# EAGLE design eight_step_sequencer (EAGLE 5.07)
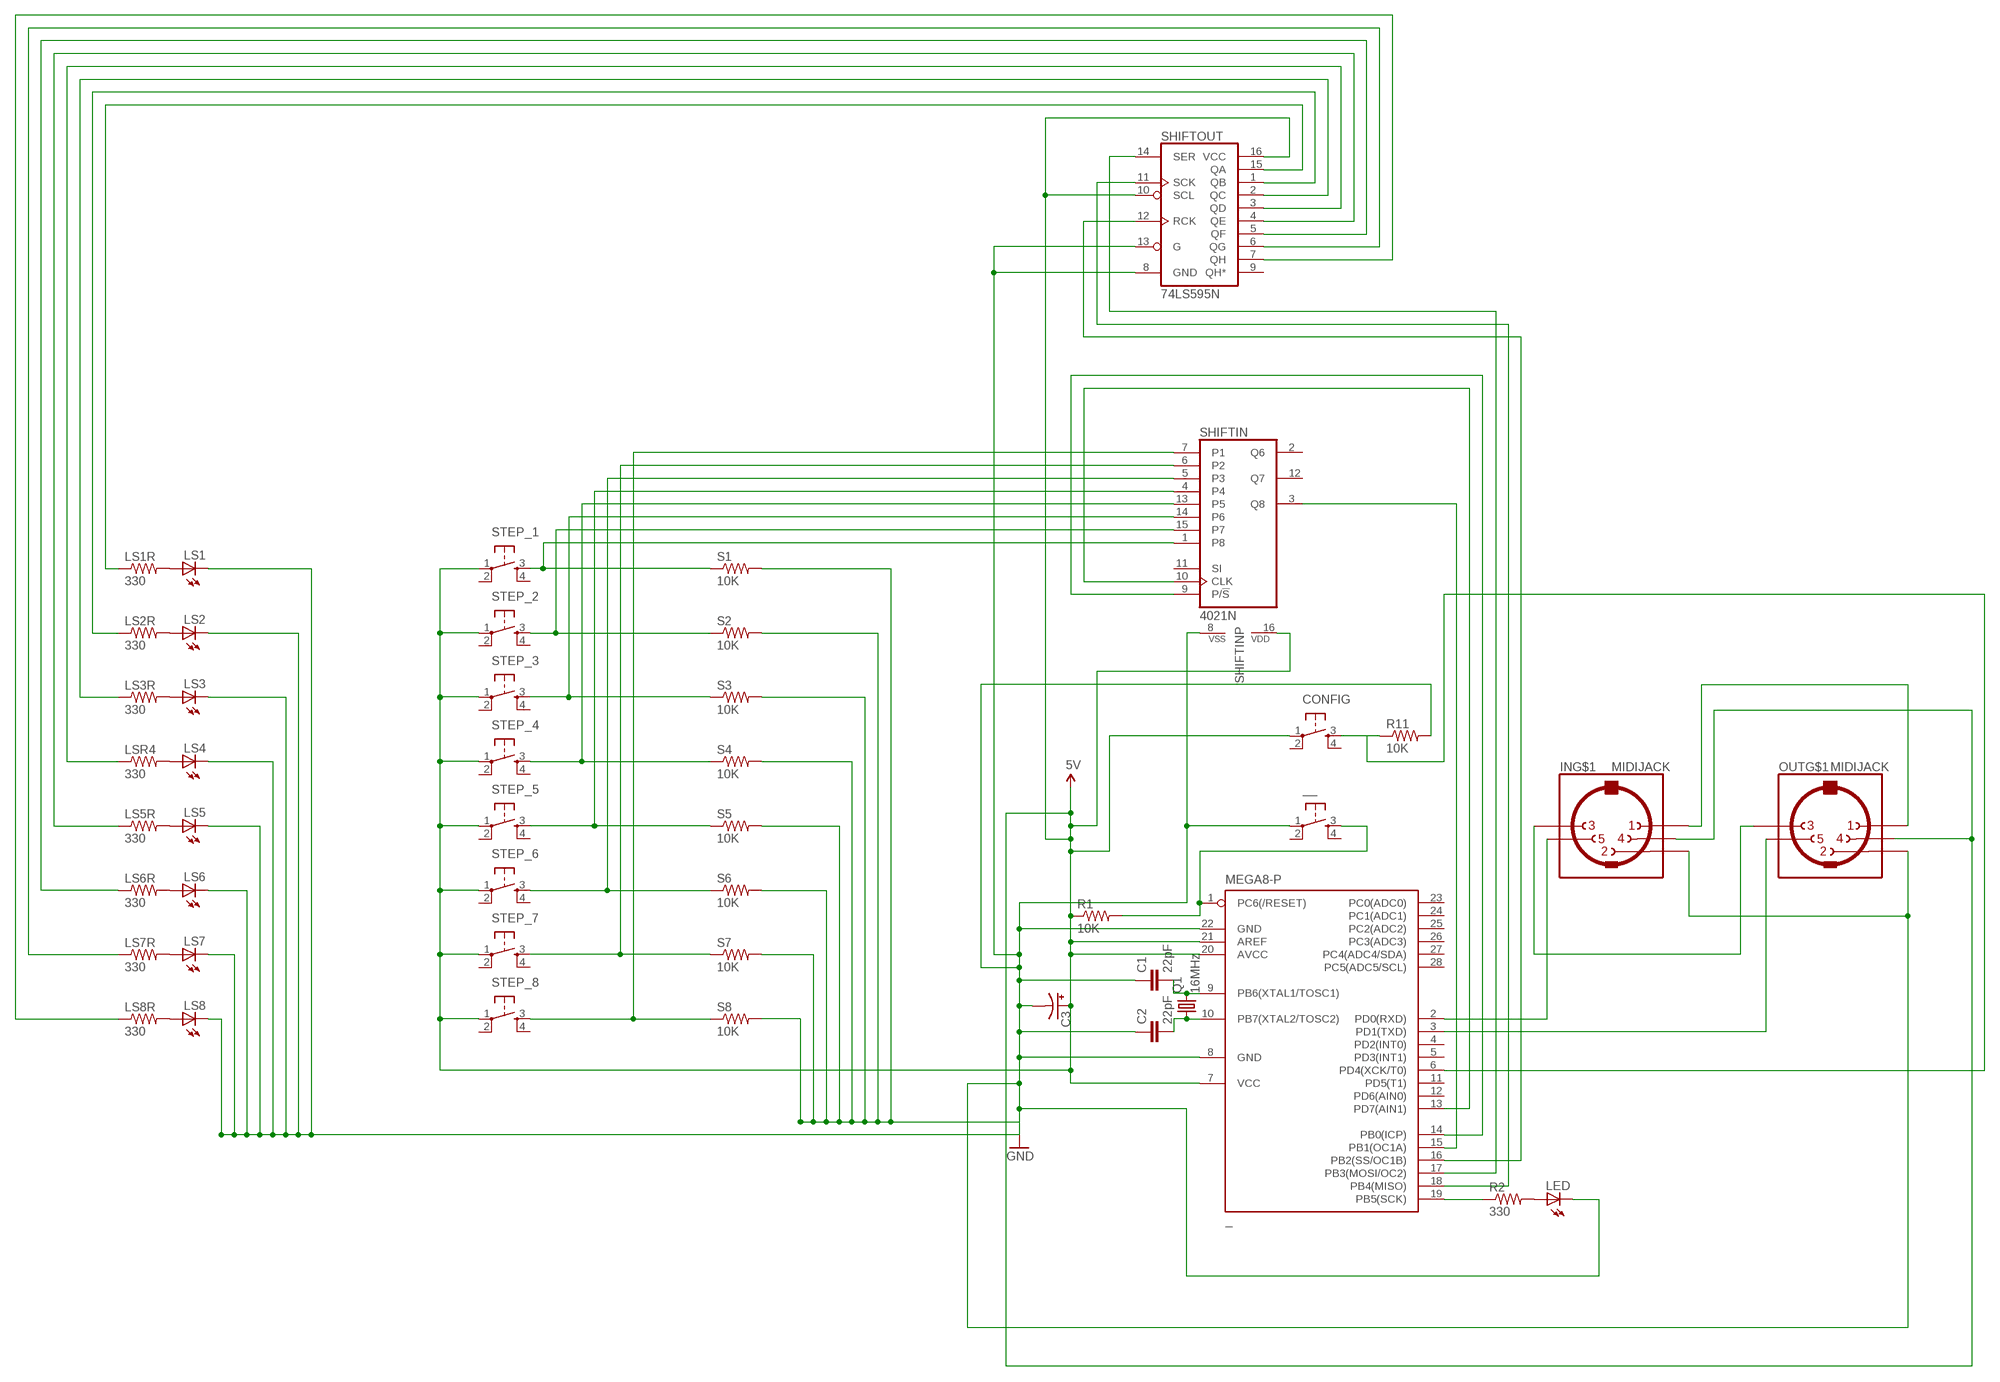
[diagram p0: schematic, sheet 1]

## Parts
_  MEGA8-P  [DIL28-3]
__  TAC_SWITCHPTH  [TACTILE-PTH]
C1  22pF  CAPPTH  [CAP-PTH-SMALL]
C2  22pF  CAPPTH  [CAP-PTH-SMALL]
C3  CAP_POLPTH2  [CPOL-RADIAL-10UF-25V]
CONFIG  TAC_SWITCHPTH  [TACTILE-PTH]
IN  MIDIJACK  [CP-2350]
LED  LED5MM  [LED5MM]
LS1  LED5MM  [LED5MM]
LS1R  330  RESISTORPTH-1/6W  [1/6W-RES]
LS2  LED5MM  [LED5MM]
LS2R  330  RESISTORPTH-1/6W  [1/6W-RES]
LS3  LED5MM  [LED5MM]
LS3R  330  RESISTORPTH-1/6W  [1/6W-RES]
LS4  LED5MM  [LED5MM]
LS5  LED5MM  [LED5MM]
LS5R  330  RESISTORPTH-1/6W  [1/6W-RES]
LS6  LED5MM  [LED5MM]
LS6R  330  RESISTORPTH-1/6W  [1/6W-RES]
LS7  LED5MM  [LED5MM]
LS7R  330  RESISTORPTH-1/6W  [1/6W-RES]
LS8  LED5MM  [LED5MM]
LS8R  330  RESISTORPTH-1/6W  [1/6W-RES]
LSR4  330  RESISTORPTH-1/6W  [1/6W-RES]
OUT  MIDIJACK  [CP-2350]
Q1  16MHz  CRYSTALHC49U-V  [HC49U-V]
R1  10K  RESISTORPTH-1/6W  [1/6W-RES]
R2  330  RESISTORPTH-1/6W  [1/6W-RES]
R11  10K  RESISTORPTH-1/6W  [1/6W-RES]
S1  10K  RESISTORPTH-1/6W  [1/6W-RES]
S2  10K  RESISTORPTH-1/6W  [1/6W-RES]
S3  10K  RESISTORPTH-1/6W  [1/6W-RES]
S4  10K  RESISTORPTH-1/6W  [1/6W-RES]
S5  10K  RESISTORPTH-1/6W  [1/6W-RES]
S6  10K  RESISTORPTH-1/6W  [1/6W-RES]
S7  10K  RESISTORPTH-1/6W  [1/6W-RES]
S8  10K  RESISTORPTH-1/6W  [1/6W-RES]
SHIFTIN  4021N  [DIL16]
SHIFTOUT  74LS595N  [DIL16]
STEP_1  TAC_SWITCHPTH  [TACTILE-PTH]
STEP_2  TAC_SWITCHPTH  [TACTILE-PTH]
STEP_3  TAC_SWITCHPTH  [TACTILE-PTH]
STEP_4  TAC_SWITCHPTH  [TACTILE-PTH]
STEP_5  TAC_SWITCHPTH  [TACTILE-PTH]
STEP_6  TAC_SWITCHPTH  [TACTILE-PTH]
STEP_7  TAC_SWITCHPTH  [TACTILE-PTH]
STEP_8  TAC_SWITCHPTH  [TACTILE-PTH]

## Nets
5V: _.7(VCC) _.20(AVCC) _.21(AREF) C3.1(+) CONFIG.1 IN.4 OUT.4 R1.1 SHIFTIN.16(VDD) SHIFTOUT.10(SCL) SHIFTOUT.16(VCC) STEP_1.1 STEP_2.1 STEP_3.1 STEP_4.1 STEP_5.1 STEP_6.1 STEP_7.1 STEP_8.1
GND: _.8(GND) _.22(GND) __.1 C1.1 C2.1 C3.2(-) IN.2 LED.K(C) LS1.K(C) LS2.K(C) LS3.K(C) LS4.K(C) LS5.K(C) LS6.K(C) LS7.K(C) LS8.K(C) OUT.2 R11.2 S1.2 S2.2 S3.2 S4.2 S5.2 S6.2 S7.2 S8.2 SHIFTIN.8(VSS) SHIFTOUT.8(GND) SHIFTOUT.13(G)
N$1: _.1(PC6(/RESET)) __.3 R1.2
N$2: _.9(PB6(XTAL1/TOSC1)) C1.2 Q1.2
N$3: _.10(PB7(XTAL2/TOSC2)) C2.2 Q1.1
N$4: _.15(PB1(OC1A)) SHIFTIN.3(Q8)
N$5: _.2(PD0(RXD)) IN.5
N$6: _.3(PD1(TXD)) OUT.5
N$7: IN.3 OUT.3
N$8: IN.1 OUT.1
N$9: _.13(PD7(AIN1)) SHIFTIN.10(CLK)
N$10: _.14(PB0(ICP)) SHIFTIN.9(P/!S)
N$11: S8.1 SHIFTIN.7(P1) STEP_8.3
N$12: _.19(PB5(SCK)) R2.1
N$13: LED.A R2.2
N$14: S1.1 SHIFTIN.1(P8) STEP_1.3
N$15: S2.1 SHIFTIN.15(P7) STEP_2.3
N$16: S3.1 SHIFTIN.14(P6) STEP_3.3
N$17: S4.1 SHIFTIN.13(P5) STEP_4.3
N$18: S5.1 SHIFTIN.4 STEP_5.3
N$19: S6.1 SHIFTIN.5(P3) STEP_6.3
N$20: S7.1 SHIFTIN.6(P2) STEP_7.3
N$21: _.17(PB3(MOSI/OC2)) SHIFTOUT.14(SER)
N$22: _.18(PB4(MISO)) SHIFTOUT.11(SCK)
N$23: _.16(PB2(SS/OC1B)) SHIFTOUT.12(RCK)
N$24: LS1.A LS1R.2
N$25: LS2.A LS2R.2
N$26: LS3.A LS3R.2
N$27: LS4.A LSR4.2
N$28: LS5.A LS5R.2
N$29: LS6.A LS6R.2
N$30: LS7.A LS7R.2
N$31: LS8.A LS8R.2
N$32: LS6R.1 SHIFTOUT.5(QF)
N$33: LS1R.1 SHIFTOUT.15(QA)
N$34: LS2R.1 SHIFTOUT.1(QB)
N$35: LS3R.1 SHIFTOUT.2(QC)
N$36: LSR4.1 SHIFTOUT.3(QD)
N$37: LS5R.1 SHIFTOUT.4(QE)
N$39: LS7R.1 SHIFTOUT.6(QG)
N$40: LS8R.1 SHIFTOUT.7(QH)
N$41: _.6(PD4(XCK/T0)) CONFIG.3 R11.1
Unconnected: _.4(PD2(INT0)) _.5(PD3(INT1)) _.11(PD5(T1)) _.12(PD6(AIN0)) _.23(PC0(ADC0)) _.24(PC1(ADC1)) _.25(PC2(ADC2)) _.26(PC3(ADC3)) _.27(PC4(ADC4/SDA)) _.28(PC5(ADC5/SCL)) __.2 __.4 CONFIG.2 CONFIG.4 IN.PE1(MT) IN.PE2(MT) IN.PE(MT) IN.PE@(MT) OUT.PE1(MT) OUT.PE2(MT) OUT.PE(MT) OUT.PE@(MT) SHIFTIN.2(Q6) SHIFTIN.11(SI) SHIFTIN.12(Q7) SHIFTOUT.9(QH*) STEP_1.2 STEP_1.4 STEP_2.2 STEP_2.4 STEP_3.2 STEP_3.4 STEP_4.2 STEP_4.4 STEP_5.2 STEP_5.4 STEP_6.2 STEP_6.4 STEP_7.2 STEP_7.4 STEP_8.2 STEP_8.4

## Library data of the parts
_ = atmel:MEGA8-P: MICROCONTROLLER 8 Kbytes FLASH, 1 kbytes SRAM, 512 bytes EEPROM, USART, 4-channel 10 bit ADC, 2-channel 8 bit ADC Pin compatible with Atmega48, ATMega88, ATMega168 Source: avr.lbr
__ CONFIG STEP_1-STEP_8 = SparkFun:TAC_SWITCH: Momentary Switch Button commonly used for reset or general input. Spark Fun Electronics SKU : COM-00097
C1 C2 = SparkFun:CAP: Capacitor Standard 0603 ceramic capacitor, and 0.1" leaded capacitor.
C3 = SparkFun:CAP_POL: Capacitor Polarized These are standard SMD and PTH capacitors. Normally 10uF, 47uF, and 100uF in electrolytic and tantalum varieties. Always verify the external diameter of the through hole cap, it varies with capacity, voltage, and manufacturer. The EIA devices should be standard.
IN OUT = adafruit:MIDIJACK: DIN 5 jack also known as MIDI jack A modification of conn-hirshman:MAB5SH with two options for the grounding 'teeth'
LED LS1-LS8 = adafruit:LED: LED OSRAM: - CHIPLED LG R971, LG N971, LY N971, LG Q971, LY Q971, LO R971, LY R971 LH N974, LH R974 LS Q976, LO Q976, LY Q976 LO Q996 - Hyper CHIPLED LW Q18S LB Q993, LB Q99A, LB R99A - SideLED LS A670, LO A670, LY A670, LG A670, LP A670 LB A673, LV A673, LT A673, LW A673 LH A674 LY A675 LS A676, LA A676, LO A676, LY A676, LW A676 LS A679, LY A679, LG A679 - Hyper Micro SIDELED® LS Y876, LA Y876, LO Y876, LY Y876 LT Y87S - SmartLED LW L88C, LW L88S LB L89C, LB L89S, LG L890 LS L89K, LO L89K, LY L89K LS L896, LA L896, LO L896, LY L896 - TOPLED LS T670, LO T670, LY T670, LG T670, LP T670 LSG T670, LSP T670, LSY T670, LOP T670, LYG T670 LG T671, LOG T671, LSG T671 LB T673, LV T673, LT T673, LW T673 LH T674 LS T676, LA T676, LO T676, LY T676, LB T676, LH T676, LSB T676, LW T676 LB T67C, LV T67C, LT T67C, LS T67K, LO T67K, LY T67K, LW E67C LS E67B, LA E67B, LO E67B, LY E67B, LB E67C, LV E67C, LT E67C LW T67C LS T679, LY T679, LG T679 LS T770, LO T770, LY T770, LG T770, LP T770 LB T773, LV T773, LT T773, LW T773 LH T774 LS E675, LA E675, LY E675, LS T675 LS T776, LA T776, LO T776, LY T776, LB T776 LHGB T686 LT T68C, LB T68C - Hyper Mini TOPLED® LB M676 - Mini TOPLED Santana® LG M470 LS M47K, LO M47K, LY M47K Source: http://www.osram.convergy.de/
LS1R LS2R LS3R LS5R LS6R LS7R LS8R LSR4 R1 R2 R11 S1-S8 = SparkFun:RESISTOR: Resistor Basic schematic elements and footprints for 0603, 1206, and PTH resistors.
Q1 = crystal:CRYSTAL: CRYSTAL
SHIFTIN = 40xx:4021: 8-bit static SHIFT REGISTER
SHIFTOUT = SparkFun:74*595: 8-bit SHIFT REGISTER, output latch

## Board
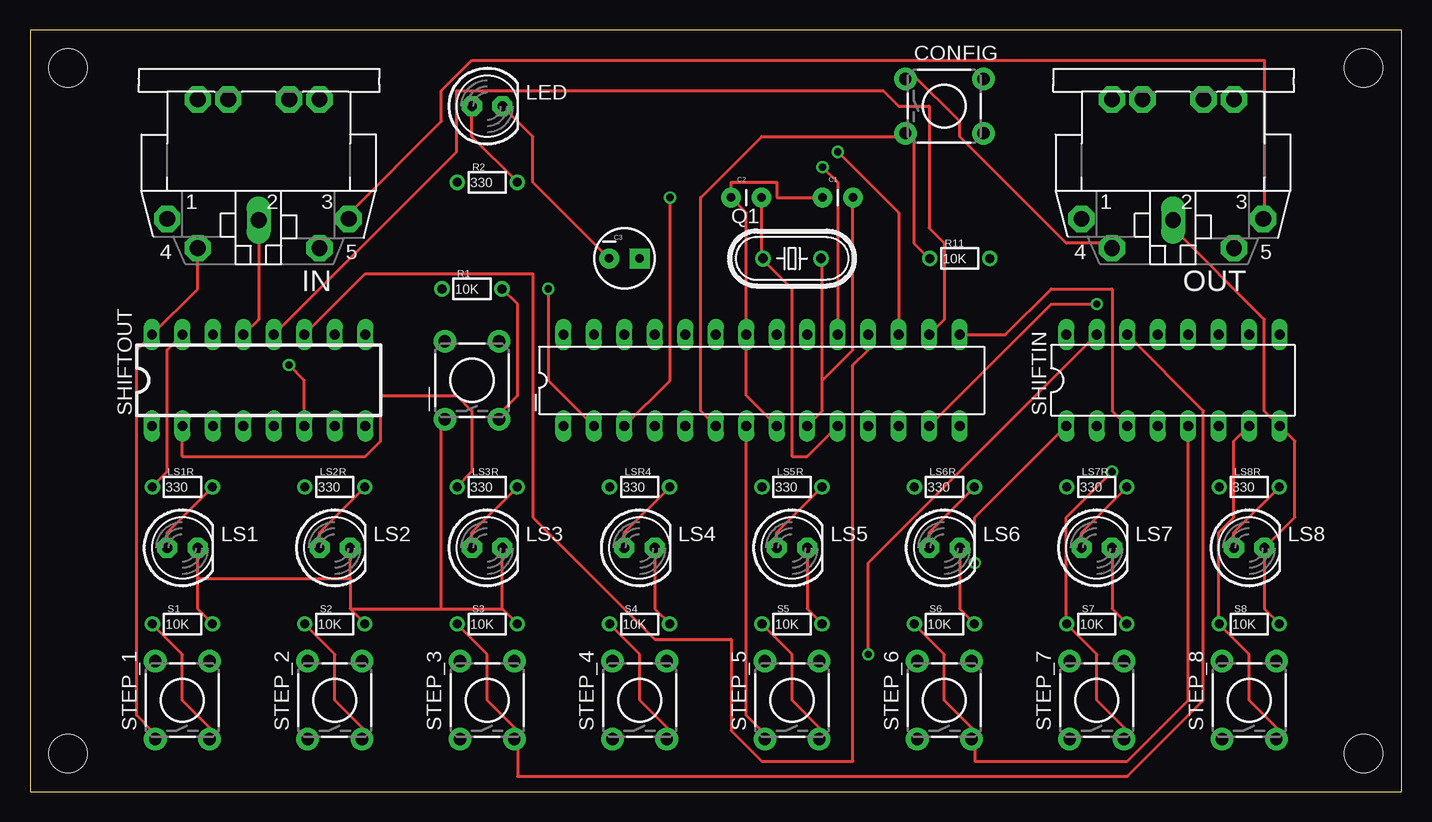
[diagram p1: board, top side]
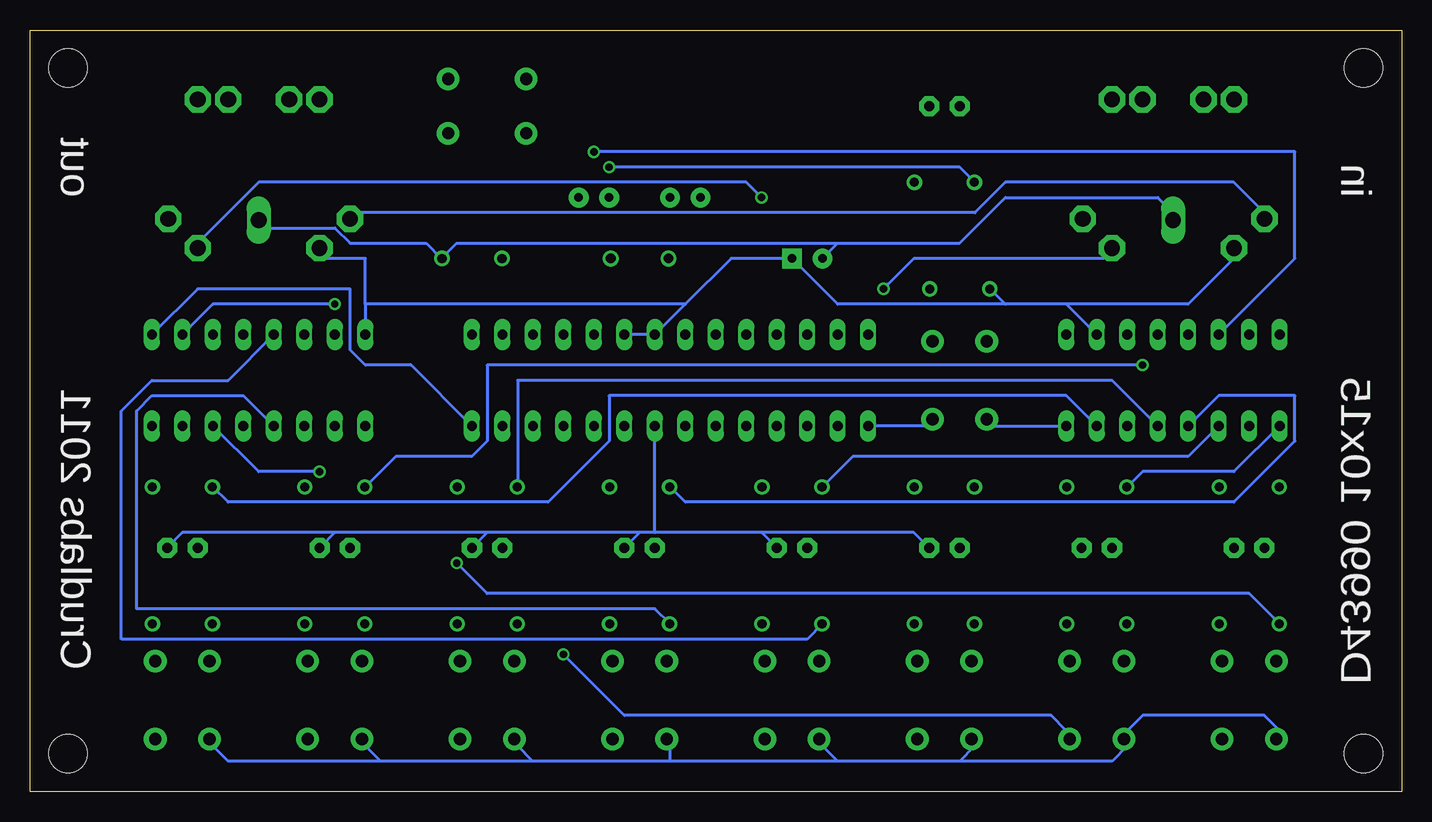
[diagram p2: board, bottom side, seen from below]

Size 114.3 x 63.5 mm. Coordinates in mm from the lower left corner, seen from the top.
Outline: 0,0 114.3,0 114.3,63.5 0,63.5 0,0
Copper layers (1*16): Top 0.035mm / dielectric 1.5mm / Bottom 0.035mm
Design rules "default": minimum track width 10mil, minimum drill 24mil, track to track 8mil, track to pad 8mil, pad to pad 8mil, via to via 8mil, smd to smd 8mil, copper to edge 40mil, drill to drill 8mil, minimum pad ring 10mil, minimum via ring 8mil, stop-mask expansion 4mil, vias tented up to drill 0mil, thermal gap 10mil
Holes 3.17 mm at 3.17,3.17 3.17,60.33 111.12,3.17 111.12,60.33

### Footprints (pad centres in the part's own frame; a part is rotated, then mirrored left to right if it is on the bottom)
DIL28-3 = drill 0.813 long: 1 -16.51,-3.81; 2 -13.97,-3.81; 3 -11.43,-3.81; 4 -8.89,-3.81; 5 -6.35,-3.81; 6 -3.81,-3.81; 7 -1.27,-3.81; 8 1.27,-3.81; 9 3.81,-3.81; 10 6.35,-3.81; 11 8.89,-3.81; 12 11.43,-3.81; 13 13.97,-3.81; 14 16.51,-3.81; 15 16.51,3.81; 16 13.97,3.81; 17 11.43,3.81; 18 8.89,3.81; 19 6.35,3.81; 20 3.81,3.81; 21 1.27,3.81; 22 -1.27,3.81; 23 -3.81,3.81; 24 -6.35,3.81; 25 -8.89,3.81; 26 -11.43,3.81; 27 -13.97,3.81; 28 -16.51,3.81
TACTILE-PTH = drill 1.016 pad 1.88 round: 1 -3.251,2.261; 2 3.251,2.261; 3 -3.251,-2.261; 4 3.251,-2.261
CAP-PTH-SMALL = drill 0.7 pad 1.651 round: 1 0,0; 2 2.54,0
CPOL-RADIAL-10UF-25V = drill 0.7 pad 1.651 square: 1 1.27,0 | drill 0.7 pad 1.651 round: 2 -1.27,0
CP-2350 = drill 1.321 pad 2.184 octagon: 1 7.62,12.58; 3 -7.52,12.58; 4 5.08,15.02; 5 -5.08,15.02; PE -2.54,2.62; PE1 -5.08,2.62; PE2 5.08,2.62; PE@ 2.54,2.62 | drill 1.321 long: 2 0,12.68
LED5MM = drill 0.813 pad 1.676 octagon: A -1.27,0; K 1.27,0
1/6W-RES = drill 0.762 round: 1 -2.5,0; 2 2.5,0
HC49U-V = drill 0.813 round: 1 -2.413,0; 2 2.413,0
DIL16 = drill 0.813 long: 1 -8.89,-3.81; 2 -6.35,-3.81; 3 -3.81,-3.81; 4 -1.27,-3.81; 5 1.27,-3.81; 6 3.81,-3.81; 7 6.35,-3.81; 8 8.89,-3.81; 9 8.89,3.81; 10 6.35,3.81; 11 3.81,3.81; 12 1.27,3.81; 13 -1.27,3.81; 14 -3.81,3.81; 15 -6.35,3.81; 16 -8.89,3.81

### Placement (x,y rotation side)
_  60.96,34.29 0 top
__  36.83,34.29 90 top
C1  66.04,49.53 0 top
C2  58.42,49.53 0 top
C3  49.53,44.45 0 top
CONFIG  76.2,57.15 0 top
IN  19.05,60.33 180 top
LED  38.1,57.15 0 top
LS1  12.7,20.32 0 top
LS1R  12.7,25.4 0 top
LS2  25.4,20.32 0 top
LS2R  25.4,25.4 0 top
LS3  38.1,20.32 0 top
LS3R  38.1,25.4 0 top
LS4  50.8,20.32 0 top
LS5  63.5,20.32 0 top
LS5R  63.5,25.4 0 top
LS6  76.2,20.32 0 top
LS6R  76.2,25.4 0 top
LS7  88.9,20.32 0 top
LS7R  88.9,25.4 0 top
LS8  101.6,20.32 0 top
LS8R  101.6,25.4 0 top
LSR4  50.8,25.4 0 top
OUT  95.25,60.33 180 top
Q1  63.5,44.45 0 top
R1  36.83,41.91 0 top
R2  38.1,50.8 0 top
R11  77.47,44.45 0 top
S1  12.7,13.97 0 top
S2  25.4,13.97 0 top
S3  38.1,13.97 0 top
S4  50.8,13.97 0 top
S5  63.5,13.97 0 top
S6  76.2,13.97 0 top
S7  88.9,13.97 0 top
S8  101.6,13.97 0 top
SHIFTIN  95.25,34.29 0 top
SHIFTOUT  19.05,34.29 0 top
STEP_1  12.7,7.62 90 top
STEP_2  25.4,7.62 90 top
STEP_3  38.1,7.62 90 top
STEP_4  50.8,7.62 90 top
STEP_5  63.5,7.62 90 top
STEP_6  76.2,7.62 90 top
STEP_7  88.9,7.62 90 top
STEP_8  101.6,7.62 90 top
U$2  [CRUDLABS_LOGO_1]  3.81,40.64 0 top

### Tracks (layer width: path | path; a pad name or v marks a point on that pad's centre or on a via)
5V
  Top 0.254: CONFIG.1 73.66,59.69 77.47,55.88 77.47,54.61 86.36,45.72 90.17,45.72 OUT.4 | IN.4 13.97,41.91 SHIFTOUT.16 8.89,36.83 8.89,6.35 10.16,5.08 STEP_1.1 | _.7 59.69,6.35 60.96,5.08 STEP_5.1
  Bottom 0.254: 86.36,40.64 86.36,44.45 90.17,44.45 OUT.4 | 86.36,40.64 SHIFTIN.16 | _.20 _.21 59.69,40.64 | 33.02,40.64 34.29,41.91 R1.1 | 27.94,40.64 33.02,40.64 | 27.94,40.64 SHIFTOUT.10 | 33.02,40.64 46.99,40.64 C3.1 55.88,44.45 59.69,40.64 | 27.94,40.64 17.78,40.64 13.97,44.45 IN.4 | 59.69,40.64 86.36,40.64 | STEP_1.1 10.16,5.08 11.43,6.35 21.59,6.35 22.86,5.08 STEP_2.1 22.86,3.81 24.13,2.54 36.83,2.54 | 36.83,2.54 35.56,3.81 STEP_3.1 | 36.83,2.54 46.99,2.54 | 46.99,2.54 48.26,3.81 STEP_4.1 | 72.39,2.54 73.66,3.81 STEP_6.1 | 46.99,2.54 60.96,2.54 | 60.96,2.54 72.39,2.54 | 85.09,2.54 86.36,3.81 STEP_7.1 | 72.39,2.54 85.09,2.54 | 85.09,2.54 97.79,2.54 99.06,3.81 STEP_8.1 | 60.96,2.54 60.96,3.81 STEP_5.1
GND
  Top 0.254: SHIFTOUT.13 19.05,39.37 IN.2 | C3.2 41.91,50.8 41.91,54.61 LED.K | 39.37,15.24 40.64,13.97 S3.2 | 39.37,15.24 LS3.K | 13.97,17.78 LS1.K | 13.97,17.78 13.97,15.24 15.24,13.97 S1.2 | 26.67,15.24 27.94,13.97 S2.2 | 26.67,17.78 LS2.K | 26.67,17.78 26.67,15.24 | 13.97,17.78 26.67,17.78 | 26.67,15.24 34.29,15.24 | 34.29,15.24 39.37,15.24 | 34.29,15.24 34.29,30.48 __.1 | _.8 59.69,33.02 _.22 59.69,48.26 C2.1 58.42,50.8 62.23,50.8 62.23,49.53 C1.1 | S8.2 104.14,13.97 102.87,15.24 LS8.K 105.41,22.86 105.41,29.21 SHIFTIN.8 102.87,31.75 102.87,39.37 95.25,46.99 OUT.2 | LS7.K 90.17,15.24 91.44,13.97 S7.2 | LS6.K 77.47,15.24 78.74,13.97 S6.2 | LS4.K 52.07,15.24 53.34,13.97 S4.2 | LS5.K 64.77,15.24 66.04,13.97 S5.2
  Bottom 0.254: 80.01,44.45 81.28,45.72 87.63,45.72 88.9,46.99 95.25,46.99 OUT.2 | 46.99,45.72 36.83,45.72 33.02,49.53 20.32,49.53 19.05,48.26 IN.2 | 46.99,45.72 C3.2 | 80.01,44.45 78.74,45.72 46.99,45.72 | 80.01,44.45 R11.2 | SHIFTOUT.8 34.29,30.48 __.1 | 53.34,21.59 LS4.K | 62.23,21.59 63.5,21.59 | 53.34,21.59 62.23,21.59 | 63.5,21.59 LS5.K | 76.2,21.59 LS6.K | 63.5,21.59 76.2,21.59 | 88.9,21.59 LS7.K | 76.2,21.59 88.9,21.59 | LS8.K 101.6,21.59 88.9,21.59 | 62.23,21.59 _.8 | LS3.K 40.64,21.59 53.34,21.59
N$1
  Top 0.254: R1.2 39.37,41.91 40.64,40.64 40.64,33.02 39.37,31.75 __.3
  Bottom 0.254: _.1 39.37,30.48 __.3
N$2
  Top 0.254: _.9 66.04,31.75 66.04,34.29 | 66.04,34.29 66.04,44.45 Q1.2 | C1.2 68.58,36.83 66.04,34.29
N$3
  Top 0.254: _.10 64.77,27.94 63.5,27.94 63.5,41.91 60.96,44.45 | 60.96,44.45 C2.2 | 60.96,44.45 Q1.1
N$4
  Top 0.254: _.15 81.28,38.1 85.09,41.91 90.17,41.91 90.17,31.75 SHIFTIN.3
N$5  (via drill 0.61)
  Top 0.254: _.2 43.18,34.29 v43.18,41.91
  Bottom 0.254: v43.18,41.91 40.64,44.45 24.13,44.45 IN.5
N$6  (via drill 0.61)
  Top 0.254: _.3 53.34,34.29 v53.34,49.53
  Bottom 0.254: v53.34,49.53 54.61,50.8 95.25,50.8 100.33,45.72 OUT.5
N$7
  Top 0.254: IN.3 26.67,48.26 34.29,55.88 34.29,58.42 36.83,60.96 102.87,60.96 102.87,48.26 OUT.3
N$8
  Bottom 0.254: IN.1 11.43,48.26 13.97,50.8 33.02,50.8 35.56,48.26 87.63,48.26 OUT.1
N$9  (via drill 0.61)
  Top 0.254: _.13 85.09,40.64 v88.9,40.64
  Bottom 0.254: v88.9,40.64 99.06,40.64 SHIFTIN.10
N$10
  Bottom 0.254: _.14 82.55,35.56 86.36,35.56 87.63,36.83 87.63,41.91 100.33,41.91 SHIFTIN.9
N$11
  Top 0.254: 99.06,13.97 101.6,11.43 101.6,7.62 104.14,5.08 STEP_8.3 | SHIFTIN.7 100.33,29.21 100.33,22.86 99.06,21.59 99.06,13.97 | 99.06,13.97 S8.1
N$12  (via drill 0.61)
  Top 0.254: v66.04,52.07 67.31,50.8 _.19
  Bottom 0.254: v66.04,52.07 36.83,52.07 35.56,50.8 R2.1
N$13
  Top 0.254: LED.A 36.83,54.61 40.64,50.8 R2.2
N$14  (via drill 0.61)
  Top 0.254: S1.1 10.16,13.97 12.7,11.43 12.7,7.62 15.24,5.08 STEP_1.3 | SHIFTIN.1 78.74,22.86 v78.74,19.05
  Bottom 0.254: v78.74,19.05 76.2,16.51 12.7,16.51 10.16,13.97 S1.1
N$15  (via drill 0.61)
  Top 0.254: S2.1 22.86,13.97 25.4,11.43 25.4,7.62 27.94,5.08 STEP_2.3 | SHIFTIN.15 69.85,19.05 v69.85,11.43
  Bottom 0.254: v69.85,11.43 64.77,6.35 29.21,6.35 27.94,5.08 STEP_2.3
N$16
  Top 0.254: S3.1 35.56,13.97 38.1,11.43 38.1,7.62 40.64,5.08 STEP_3.3 40.64,3.81 40.64,1.27 91.44,1.27 97.79,7.62 97.79,31.75 SHIFTIN.14
N$17
  Top 0.254: S4.1 48.26,13.97 50.8,11.43 50.8,7.62 53.34,5.08 STEP_4.3
  Bottom 0.254: SHIFTIN.13 97.79,34.29 104.14,34.29 106.68,31.75 106.68,12.7 49.53,12.7 48.26,13.97 S4.1
N$18
  Top 0.254: S5.1 60.96,13.97 63.5,11.43 63.5,7.62 66.04,5.08 STEP_5.3
  Bottom 0.254: SHIFTIN.4 96.52,33.02 104.14,33.02 105.41,31.75 105.41,15.24 62.23,15.24 60.96,13.97 S5.1
N$19
  Top 0.254: S6.1 73.66,13.97 76.2,11.43 76.2,7.62 78.74,5.08 STEP_6.3 78.74,3.81 78.74,2.54 91.44,2.54 96.52,7.62 SHIFTIN.5
N$20  (via drill 0.61)
  Top 0.254: 86.36,13.97 88.9,11.43 88.9,7.62 91.44,5.08 STEP_7.3 | v90.17,26.67 86.36,22.86 86.36,13.97 | 86.36,13.97 S7.1
  Bottom 0.254: SHIFTIN.6 95.25,26.67 v90.17,26.67
N$21  (via drill 0.61)
  Top 0.254: v67.31,53.34 72.39,48.26 _.17
  Bottom 0.254: SHIFTOUT.14 8.89,44.45 8.89,53.34 v67.31,53.34
N$22
  Top 0.254: SHIFTOUT.11 27.94,43.18 41.91,43.18 41.91,22.86 52.07,12.7 58.42,12.7 58.42,5.08 60.96,2.54 68.58,2.54 68.58,35.56 69.85,36.83 _.18
N$23
  Top 0.254: SHIFTOUT.12 35.56,53.34 35.56,58.42 71.12,58.42 72.39,57.15 74.93,57.15 74.93,46.99 76.2,45.72 76.2,39.37 _.16
N$24
  Top 0.254: LS1.A 11.43,21.59 15.24,25.4 LS1R.2
N$25
  Top 0.254: LS2.A 24.13,21.59 27.94,25.4 LS2R.2
N$26
  Top 0.254: LS3.A 36.83,21.59 40.64,25.4 LS3R.2
N$27
  Top 0.254: LS4.A 49.53,21.59 53.34,25.4 LSR4.2
N$28
  Top 0.254: LS5.A 62.23,21.59 66.04,25.4 LS5R.2
N$29
  Top 0.254: LS6.A 74.93,21.59 78.74,25.4 LS6R.2
N$30
  Top 0.254: LS7.A 87.63,21.59 91.44,25.4 LS7R.2
N$31
  Top 0.254: LS8.A 100.33,21.59 104.14,25.4 LS8R.2
N$32
  Bottom 0.254: SHIFTOUT.5 24.13,34.29 73.66,34.29 73.66,25.4 LS6R.1
N$33
  Top 0.254: SHIFTOUT.15 11.43,36.83 11.43,26.67 10.16,25.4 LS1R.1
N$34
  Bottom 0.254: SHIFTOUT.1 13.97,26.67 21.59,26.67 22.86,25.4 LS2R.1
N$35
  Top 0.254: SHIFTOUT.2 12.7,27.94 27.94,27.94 29.21,29.21 29.21,33.02 35.56,33.02 36.83,31.75 36.83,26.67 35.56,25.4 LS3R.1
N$36
  Bottom 0.254: SHIFTOUT.3 17.78,27.94 45.72,27.94 48.26,25.4 LSR4.1
N$37
  Bottom 0.254: SHIFTOUT.4 15.24,33.02 8.89,33.02 8.89,29.21 13.97,24.13 59.69,24.13 60.96,25.4 LS5R.1
N$39  (via drill 0.61)
  Top 0.254: v21.59,35.56 22.86,34.29 SHIFTOUT.6
  Bottom 0.254: v21.59,35.56 76.2,35.56 76.2,29.21 77.47,27.94 83.82,27.94 86.36,25.4 LS7R.1
N$40
  Bottom 0.254: SHIFTOUT.7 27.94,33.02 66.04,33.02 66.04,29.21 71.12,24.13 97.79,24.13 99.06,25.4 LS8R.1
N$41
  Top 0.254: R11.1 74.93,44.45 73.66,45.72 73.66,54.61 CONFIG.3 72.39,54.61 60.96,54.61 55.88,49.53 55.88,31.75 _.6

### Text on the board
bPlace: in | out | Crudlabs 2011 | D43990 10x15